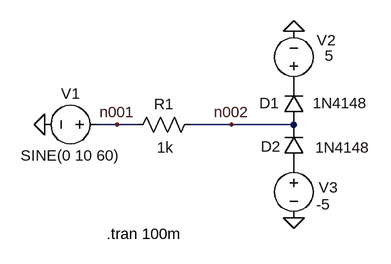
[diagram p0: schematic c01ex22s01.asc]
c01ex22s01.asc, the LTspice schematic file:
Version 4
SHEET 1 880 680
WIRE -48 128 -80 128
WIRE -16 128 -48 128
WIRE 128 128 64 128
WIRE 224 128 128 128
FLAG 224 272 0
FLAG -160 128 0
FLAG 224 -16 0
FLAG -48 128 n001
FLAG 128 128 n002
SYMBOL diode 240 128 R180
WINDOW 0 38 33 Left 2
WINDOW 3 -98 33 Left 2
SYMATTR InstName D1
SYMATTR Value 1N4148
SYMBOL diode 240 192 R180
WINDOW 0 36 30 Left 2
WINDOW 3 -102 29 Left 2
SYMATTR InstName D2
SYMATTR Value 1N4148
SYMBOL voltage -64 128 R90
WINDOW 0 -32 56 VBottom 2
WINDOW 3 32 56 VTop 2
WINDOW 123 0 0 Left 0
WINDOW 39 0 0 Left 0
SYMATTR InstName V1
SYMATTR Value SINE(0 10 60)
SYMBOL voltage 224 80 R180
WINDOW 0 -65 82 Left 2
WINDOW 3 -61 58 Left 2
WINDOW 123 0 0 Left 0
WINDOW 39 0 0 Left 0
SYMATTR InstName V2
SYMATTR Value 5
SYMBOL voltage 224 176 R0
WINDOW 0 39 49 Left 2
WINDOW 3 35 75 Left 2
WINDOW 123 0 0 Left 0
WINDOW 39 0 0 Left 0
SYMATTR InstName V3
SYMATTR Value -5
SYMBOL res -32 144 R270
WINDOW 0 32 56 VTop 2
WINDOW 3 -4 58 VBottom 2
SYMATTR InstName R1
SYMATTR Value 1k
TEXT -64 296 Left 2 !.tran 100m

The netlist it stands for:
* c01ex22s01.asc
D1 n002 P001 1N4148
D2 P002 n002 1N4148
V1 n001 0 SINE(0 10 60)
V2 P001 0 5
V3 P002 0 -5
R1 n001 n002 1k
.model D D
.lib standard.dio
.tran 100m
.backanno
.end